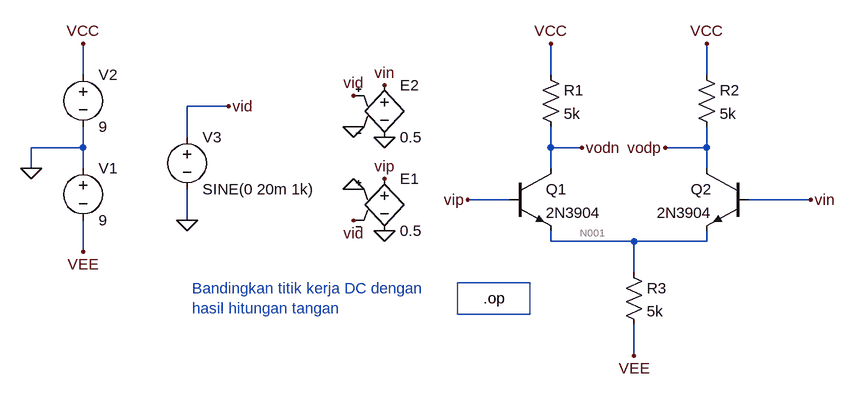
[diagram p0: schematic Perc-01-01-operatingpoint.asc]
Perc-01-01-operatingpoint.asc, the LTspice schematic file:
Version 4
SHEET 1 880 680
WIRE -320 -32 -320 -80
WIRE 400 -32 400 -80
WIRE 640 -32 640 -80
WIRE -96 16 -160 16
WIRE -160 64 -160 16
WIRE -320 80 -320 48
WIRE -320 80 -400 80
WIRE 400 80 400 48
WIRE 448 80 400 80
WIRE 640 80 640 48
WIRE 640 80 576 80
WIRE -400 112 -400 80
WIRE -320 112 -320 80
WIRE 400 112 400 80
WIRE 640 112 640 80
WIRE 336 160 272 160
WIRE 800 160 704 160
WIRE -160 192 -160 144
WIRE 400 224 400 208
WIRE 528 224 400 224
WIRE 640 224 640 208
WIRE 640 224 528 224
WIRE -320 240 -320 192
WIRE 528 272 528 224
WIRE 528 400 528 352
FLAG 400 -80 VCC
FLAG 640 -80 VCC
FLAG 528 400 VEE
FLAG 448 80 vodn
FLAG 576 80 vodp
FLAG -320 -80 VCC
FLAG -320 240 VEE
FLAG -400 112 0
FLAG -160 192 0
FLAG -96 16 vid
FLAG 96 0 vid
FLAG 96 192 vid
FLAG 144 -16 vin
FLAG 800 160 vin
FLAG 272 160 vip
FLAG 144 64 0
FLAG 96 48 0
FLAG 96 144 0
FLAG 144 208 0
FLAG 144 128 vip
SYMBOL npn 336 112 R0
SYMATTR InstName Q1
SYMATTR Value 2N3904
SYMBOL npn 704 112 M0
SYMATTR InstName Q2
SYMATTR Value 2N3904
SYMBOL res 384 -48 R0
SYMATTR InstName R1
SYMATTR Value 5k
SYMBOL res 624 -48 R0
SYMATTR InstName R2
SYMATTR Value 5k
SYMBOL res 512 256 R0
SYMATTR InstName R3
SYMATTR Value 5k
SYMBOL voltage -320 96 R0
WINDOW 123 0 0 Left 0
WINDOW 39 0 0 Left 0
SYMATTR InstName V1
SYMATTR Value 9
SYMBOL voltage -320 -48 R0
WINDOW 123 0 0 Left 0
WINDOW 39 0 0 Left 0
SYMATTR InstName V2
SYMATTR Value 9
SYMBOL voltage -160 48 R0
WINDOW 123 0 0 Left 0
WINDOW 39 0 0 Left 0
SYMATTR InstName V3
SYMATTR Value SINE(0 20m 1k)
SYMBOL e 144 112 R0
SYMATTR InstName E1
SYMATTR Value 0.5
SYMBOL e 144 -32 R0
SYMATTR InstName E2
SYMATTR Value 0.5
TEXT 296 312 Left 2 !.op
TEXT -152 296 Left 2 ;Bandingkan titik kerja DC dengan\nhasil hitungan tangan
RECTANGLE Normal 368 336 256 288

The netlist it stands for:
* Perc-01-01-operatingpoint.asc
Q1 vodn vip N001 0 2N3904
Q2 vodp vin N001 0 2N3904
R1 VCC vodn 5k
R2 VCC vodp 5k
R3 N001 VEE 5k
V1 0 VEE 9
V2 VCC 0 9
V3 vid 0 SINE(0 20m 1k)
E1 vip 0 0 vid 0.5
E2 vin 0 vid 0 0.5
.model NPN NPN
.model PNP PNP
.lib standard.bjt
.op
* Bandingkan titik kerja DC dengan
* hasil hitungan tangan
.backanno
.end

* Results of the author's LTspice run, read from the files saved beside the schematic
* Operating Point:
*   V(vodn) = 4.838 V
*   V(vip) = 0 V
*   V(n001) = -649.3 mV
*   V(vodp) = 4.838 V
*   V(vin) = 0 V
*   V(vcc) = 9 V
*   V(vee) = -9 V
*   V(vid) = 0 V
*   Ic(Q2) = 832.4 µA
*   Ib(Q2) = 2.652 µA
*   Ie(Q2) = -835.1 µA
*   Ic(Q1) = 832.4 µA
*   Ib(Q1) = 2.652 µA
*   Ie(Q1) = -835.1 µA
*   I(R3) = 1.67 mA
*   I(R2) = 832.4 µA
*   I(R1) = 832.4 µA
*   I(E2) = -2.652 µA
*   I(E1) = -2.652 µA
*   I(V3) = 0 A
*   I(V2) = -1.665 mA
*   I(V1) = -1.67 mA
* From the log:
*   Semiconductor Device Operating Points:
*                           --- Bipolar Transistors ---
*   Name:       q2          q1
*   Model:    2n3904      2n3904
*   Ib:       2.65e-06    2.65e-06
*   Ic:       8.32e-04    8.32e-04
*   Vbe:      6.49e-01    6.49e-01
*   Vbc:     -4.84e+00   -4.84e+00
*   Vce:      5.49e+00    5.49e+00
*   BetaDC:   3.14e+02    3.14e+02
*   Gm:       3.21e-02    3.21e-02
*   Rpi:      9.75e+03    9.75e+03
*   Rx:       2.00e+01    2.00e+01
*   Ro:       1.26e+05    1.26e+05
*   Cbe:      2.37e-11    2.37e-11
*   Cbc:      2.06e-12    2.06e-12
*   Cjs:      0.00e+00    0.00e+00
*   BetaAC:   3.13e+02    3.13e+02
*   Cbx:      0.00e+00    0.00e+00
*   Ft:       1.98e+08    1.98e+08